# Altium schematic sheet SX126xMB2xAS_e588v01a.SchDoc
size A3; DocumentNumber: 1; SheetNumber: 1; SheetTotal: 2
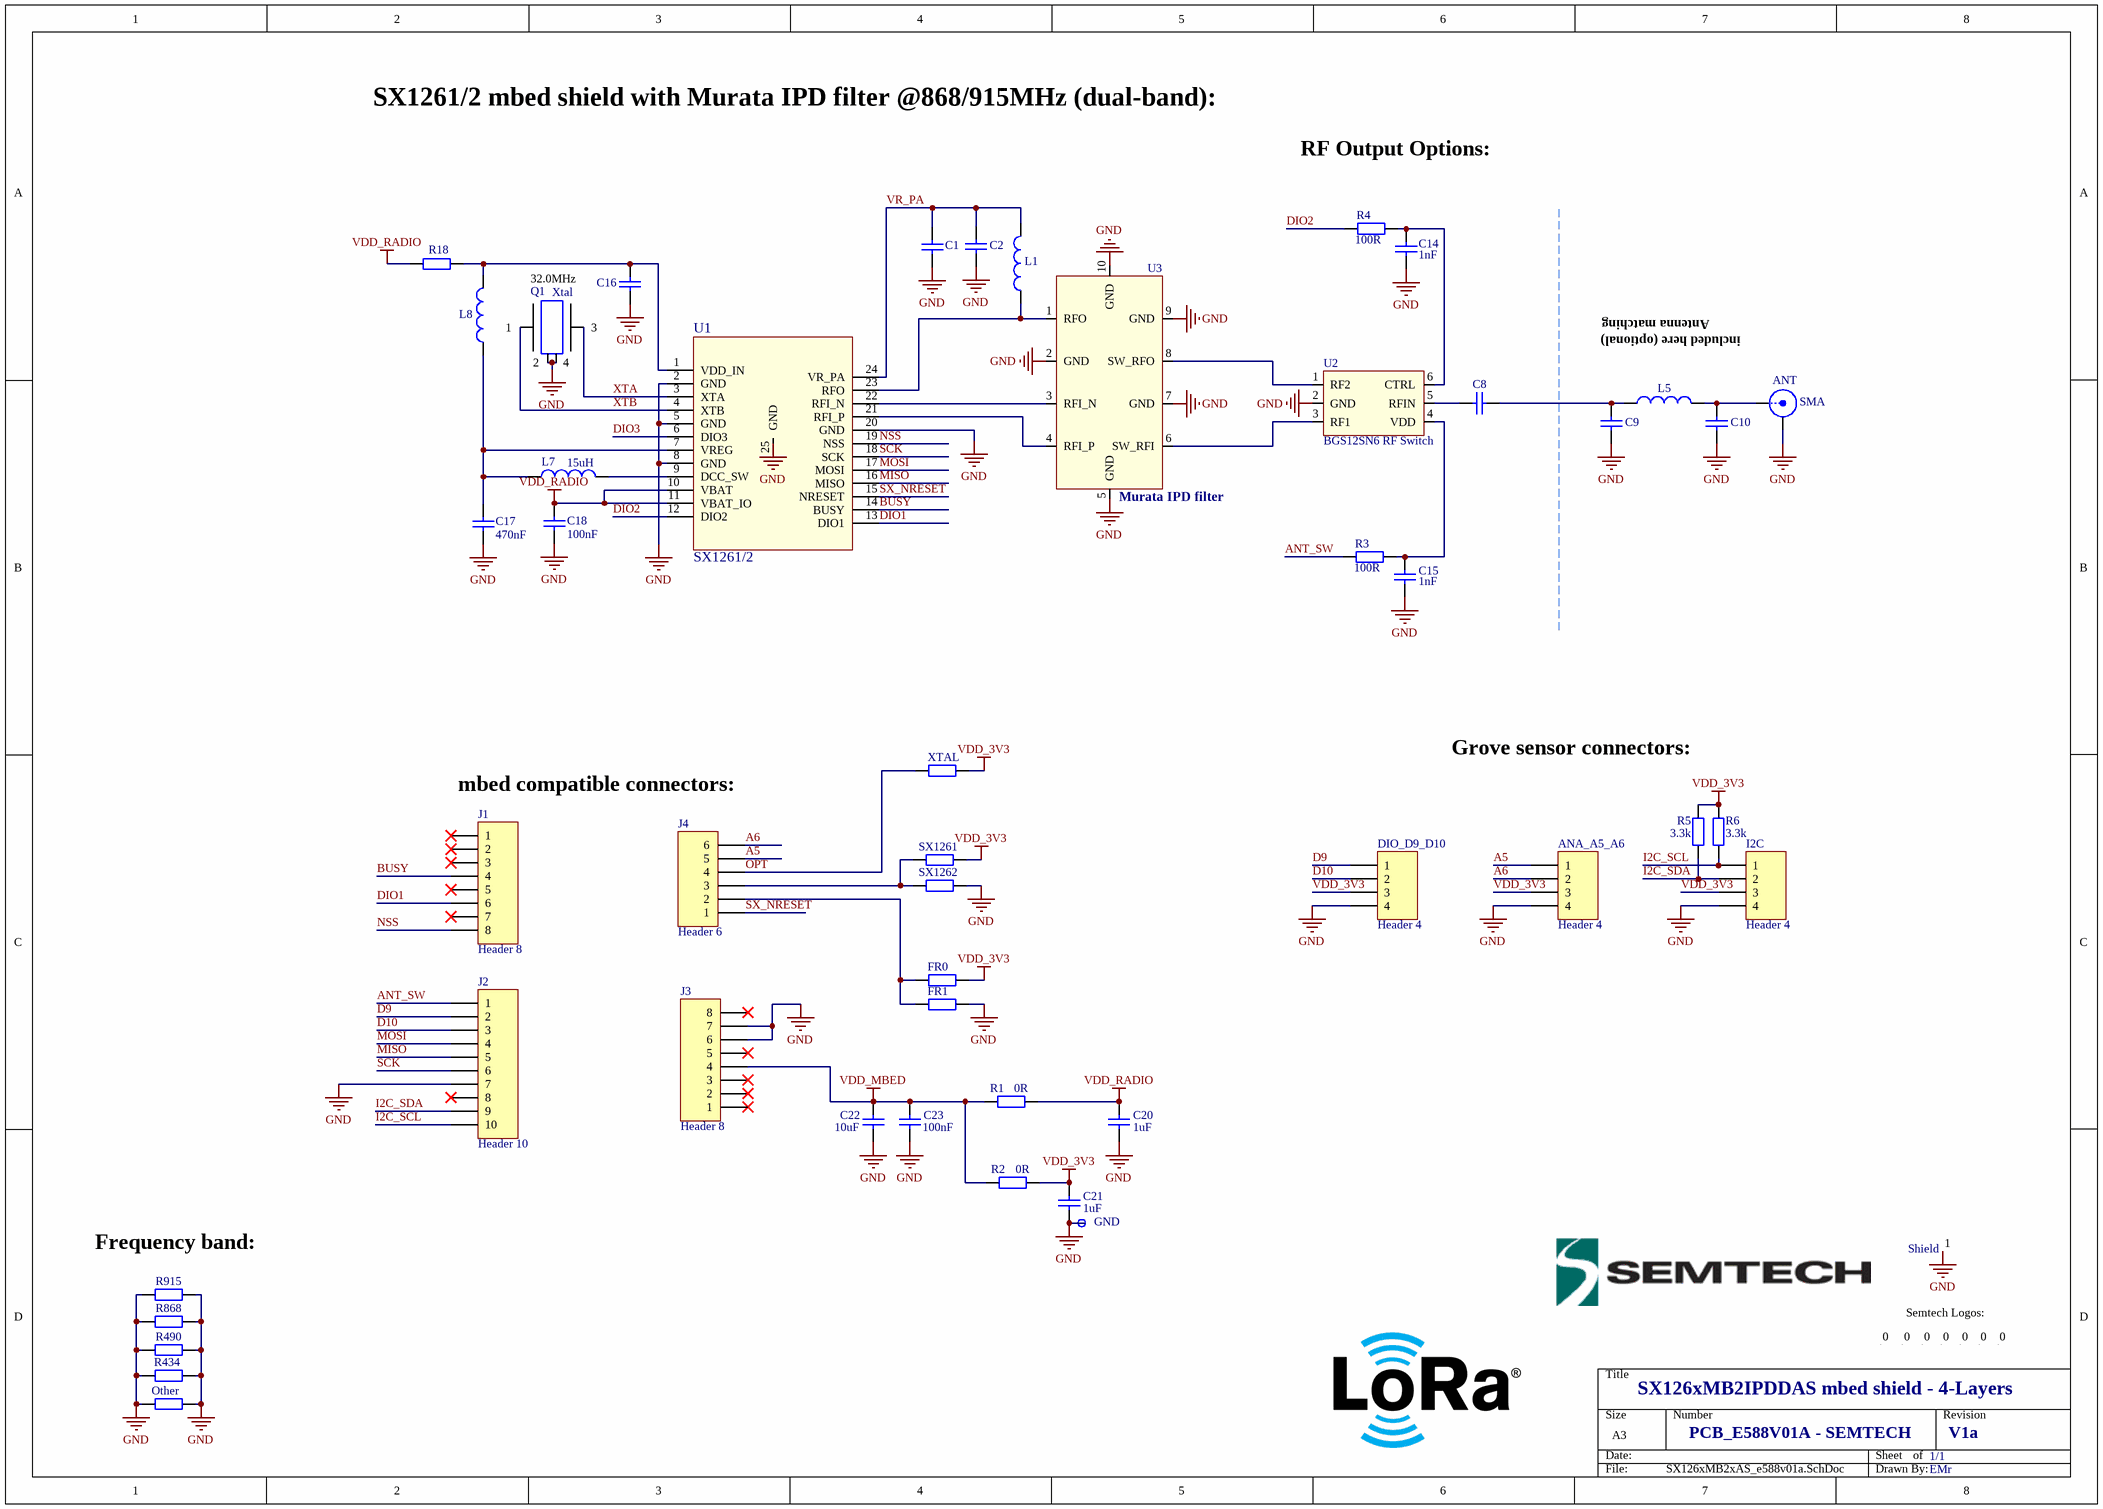
[diagram p0: SX126xMB2xAS_e588v01a.SchDoc]

## Parts
ANA_A5_A6  Header 4  [1125S-4P_connector]
ANT  SMA  [SMA_end_launch_1.0mm_9.52mm]
C1  Cap  [rlc_201_smd]  (value not drawn)
C2  Cap  [rlc_201_smd]  (value not drawn)
C8  Cap  [rlc_201_smd]  (value not drawn)
C9  Cap  [rlc_201_smd]  (value not drawn)
C10  Cap  [rlc_201_smd]  (value not drawn)
C14  value 1nF  [rlc_201_smd]  (hidden comment: Cap)
C15  value 1nF  [rlc_201_smd]  (hidden comment: Cap)
C16  Cap  [rlc_402_smd_small]  (value not drawn)
C17  value 470nF  [rlc_402_smd_small]  (hidden comment: Cap)
C18  value 100nF  [rlc_201_smd]  (hidden comment: Cap)
C20  value 1uF  [rlc_603_smd]  (hidden comment: Cap)
C21  value 1uF  [rlc_603_smd]  (hidden comment: Cap)
C22  value 10uF  [rlc_603_smd]  (hidden comment: Cap)
C23  value 100nF  [rlc_201_smd]  (hidden comment: Cap)
DIO_D9_D10  Header 4  [1125S-4P_connector]
FR0  Resistor  [rlc_402_smd]  (value not drawn)
FR1  Resistor  [rlc_402_smd]  (value not drawn)
GND  Test Pin  [pin_0.9mm]  (value not drawn)
I2C  Header 4  [1125S-4P_connector]
J1  Header 8  [HDR1X8]
J2  Header 10  [HDR1X10]
J3  Header 8  [HDR1X8]
J4  Header 6  [HDR1X6]
L1  Inductor  [rlc_402_smd_small]  (value not drawn)
L5  Inductor  [rlc_201_smd]  (value not drawn)
L7  value 15uH  [rlc_805_smd_small]  (hidden comment: Inductor)
L8  Inductor  [rlc_402_smd_small]  (value not drawn)
Logo_Bot1  Logo symbol  [Logo LoRa Size4]  (value not drawn)
Logo_ESD1  Logo symbol  [Logo ESD]  (value not drawn)
Logo_LoRA_Top1  Logo symbol  [Logo LoRa Size4]  (value not drawn)
Logo_mbed1  Logo symbol  [logo mbed 2]  (value not drawn)
Logo_Recycling1  Logo symbol  [Logo Recycling1]  (value not drawn)
Logo_Semtech1  Logo symbol  [logo_semtech_horiz_size4]  (value not drawn)
Logo_Semtech_1  Logo symbol  [logo_semtech_horiz_size3]  (value not drawn)
Other  Resistor  [rlc_402_smd]  (value not drawn)
Q1  Xtal  value 32.0MHz  [nd2016da]
R1  value 0R  [rlc_603_smd]  (hidden comment: Resistor)
R2  value 0R  [rlc_603_smd]  (hidden comment: Resistor)
R3  value 100R  [rlc_201_smd]  (hidden comment: Resistor)
R4  value 100R  [rlc_201_smd]  (hidden comment: Resistor)
R5  value 3.3k  [rlc_201_smd]  (hidden comment: Resistor)
R6  value 3.3k  [rlc_201_smd]  (hidden comment: Resistor)
R18  Resistor  [rlc_402_smd_small]  (value not drawn)
R434  Resistor  [rlc_402_smd]  (value not drawn)
R490  Resistor  [rlc_402_smd]  (value not drawn)
R868  Resistor  [rlc_402_smd]  (value not drawn)
R915  Resistor  [rlc_402_smd]  (value not drawn)
Shield  Logo symbol  [BMIS-209-F - Shield]  (value not drawn)
SX1261  Resistor  [rlc_402_smd]  (value not drawn)
SX1262  Resistor  [rlc_402_smd]  (value not drawn)
U1  SX1261/2  [vqfn24_4x4mm]
U2  BGS12SN6 RF Switch  [TSNP-6-2]
U3  Murata IPD filter  [IPD Filter]
XTAL  Resistor  [rlc_402_smd]  (value not drawn)

## Nets
GND: ANA_A5_A6.4 ANT.2(GND) C1.1 C2.1 C9.1 C10.1 C14.2 C15.2 C16.1 C17.1 C18.1 C20.1 C21.1 C22.1 C23.1 DIO_D9_D10.4 FR1.1 GND.1(pin) I2C.4 J2.7 J3.6 J3.7 Other.1 Other.2 Q1.2 Q1.4 R434.1 R434.2 R490.1 R490.2 R868.1 R868.2 R915.1 R915.2 Shield.1 SX1262.1 U1.2(GND) U1.5(GND) U1.8(GND) U1.20(GND) U1.25(GND) U2.2(GND) U3.2(GND) U3.5(GND) U3.7(GND) U3.9(GND) U3.10(GND)
VDD_3V3: ANA_A5_A6.3 C21.2 DIO_D9_D10.3 FR0.1 I2C.3 R2.1 R5.2 R6.2 SX1261.1 XTAL.1
VDD_MBED: C22.2 C23.2 J3.4 R1.2 R2.2
VDD_RADIO: C18.2 C20.2 R1.1 R18.2 U1.10(VBAT) U1.11(VBAT_IO)
A5: ANA_A5_A6.1 J4.5
A6: ANA_A5_A6.2 J4.6
ANT_SW: J2.1 R3.2
BUSY: J1.4 U1.14(BUSY)
D9: DIO_D9_D10.1 J2.2
D10: DIO_D9_D10.2 J2.3
DIO1: J1.6 U1.13(DIO1)
DIO2: R4.2 U1.12(DIO2)
DIO3: U1.6(DIO3)
I2C_SCL: I2C.1 J2.10 R6.1
I2C_SDA: I2C.2 J2.9 R5.1
MISO: J2.5 U1.16(MISO)
MOSI: J2.4 U1.17(MOSI)
NSS: J1.8 U1.19(NSS)
OPT: J4.4 XTAL.2
SCK: J2.6 U1.18(SCK)
SX_NRESET: J4.1 U1.15(NRESET)
VR_PA: C1.2 C2.2 L1.2 U1.24(VR_PA)
XTA: Q1.3 U1.3(XTA)
XTB: Q1.1 U1.4(XTB)
NetANT_1: ANT.1(Signal) C10.2 L5.2
NetC8_1: C8.1 C9.2 L5.1
NetC8_2: C8.2 U2.5(RFIN)
NetC14_1: C14.1 R4.1 U2.6(CTRL)
NetC15_1: C15.1 R3.1 U2.4(VDD)
NetC16_2: C16.2 L8.1 R18.1 U1.1(VDD_IN)
NetC17_2: C17.2 L7.1 L8.2 U1.7(VREG)
NetFR0_2: FR0.2 FR1.2 J4.2
NetJ4_3: J4.3 SX1261.2 SX1262.2
NetL1_1: L1.1 U1.23(RFO) U3.1(RFO)
NetL7_2: L7.2 U1.9(DCC_SW)
NetU1_21: U1.21(RFI_P) U3.4(RFI_P)
NetU1_22: U1.22(RFI_N) U3.3(RFI_N)
NetU2_1: U2.1(RF2) U3.8(SW_RFO)
NetU2_3: U2.3(RF1) U3.6(SW_RFI)

Not connected (* = marked no-connect by the designer): J1 1* 2* 3* 5* 7*; J2 8*; J3 1* 2* 3* 5* 8*; Logo_Bot1 0; Logo_ESD1 0; Logo_LoRA_Top1 0; Logo_mbed1 0; Logo_Recycling1 0; Logo_Semtech1 0; Logo_Semtech_1 0

## Notes on the sheet
- SX1261/2 mbed shield with Murata IPD filter @868/915MHz (dual-band):
- RF Output Options:
- Antenna matching
- included here (optional)
- Grove sensor connectors:
- mbed compatible connectors:
- (near R915) Frequency band:
- Semtech Logos:
- SX126xMB2IPDDAS mbed shield - 4-Layers
- PCB_E588V01A - SEMTECH
- 1/1
- V1a
- EMr

## Library data of the parts
ANA_A5_A6 DIO_D9_D10 I2C = Header 4: Header, 4-Pin; LatestRevisionDate: 17-Jul-2002; LatestRevisionNote: Re-released for DXP Platform.; Publisher: Altium Limited
ANT = SMA: SMA Straight Connector; LatestRevisionDate: 05-oct-2007  -  Semtech; LatestRevisionNote: Re-released for DXP Platform.; Publisher: Altium Limited
C1 C2 C8-C10 C16 = Cap: Capacitor SMD; Value: VAL?; Published: 8-Jun-2000; LatestRevisionDate: 05-oct-2007  -  Semtech; LatestRevisionNote: Re-released for DXP Platform.; Publisher: Altium Limited
C14 C15 C17 C18 C20-C23 = Cap: Capacitor SMD; Published: 8-Jun-2000; LatestRevisionDate: 05-oct-2007  -  Semtech; LatestRevisionNote: Re-released for DXP Platform.; Publisher: Altium Limited
FR0 XTAL = Resistor: Resistor SMD - IEC symbol version; Value: 1k; LatestRevisionDate: 27-Jul-20  -  Semtech
FR1 Other R434 R490 R868 R915 SX1261 = Resistor: Resistor SMD - IEC symbol version; Value: NC; LatestRevisionDate: 27-Jul-20  -  Semtech
GND = test_pin: LatestRevisionDate: 05-oct-2007  -  Semtech
J1 J3 = Header 8: Header, 8-Pin; LatestRevisionDate: 17-Jul-2002; LatestRevisionNote: Re-released for DXP Platform.; Publisher: Altium Limited
J2 = Header 10: Header, 10-Pin; LatestRevisionDate: 17-Jul-2002; LatestRevisionNote: Re-released for DXP Platform.; Publisher: Altium Limited
J4 = Header 6: Header, 6-Pin; LatestRevisionDate: 17-Jul-2002; LatestRevisionNote: Re-released for DXP Platform.; Publisher: Altium Limited
L1 L5 = Inductor: Inductor SMD; Code_IEC: 1005; Value: VAL?; Published: 8-Jun-2000; LatestRevisionDate: 05-oct-2007  -  Semtech; LatestRevisionNote: Re-released for DXP Platform.; Publisher: Altium Limited; Code_JEITA: 0402
L7 = Inductor: Inductor SMD; Code_IEC: 1005; Published: 8-Jun-2000; LatestRevisionDate: 05-oct-2007  -  Semtech; LatestRevisionNote: Re-released for DXP Platform.; Publisher: Altium Limited; Code_JEITA: 0402
L8 = Inductor: Inductor SMD; Value: NC; Code_IEC: 1005; LatestRevisionDate: 05-oct-2007  -  Semtech; Published: 8-Jun-2000; LatestRevisionNote: Re-released for DXP Platform.; Publisher: Altium Limited; Code_JEITA: 0402
Logo_Bot1 Logo_ESD1 Logo_LoRA_Top1 Logo_mbed1 Logo_Recycling1 Logo_Semtech1 Logo_Semtech_1 = Logo: Schematic symbol for Logo
Q1 = Xtal GND: Crystal with GND pins; LatestRevisionDate: 05-oct-2007  -  Semtech
R1-R6 = Resistor: Resistor SMD - IEC symbol version; LatestRevisionDate: 27-Jul-20  -  Semtech
R18 = Resistor: Resistor SMD - IEC symbol version; Value: 0R; LatestRevisionDate: 27-Jul-20  -  Semtech
Shield = Shield: Shield - EMI Gasket - Standard Surface Mount Shields
SX1262 = Resistor: Resistor SMD - IEC symbol version; Value: 10k; LatestRevisionDate: 27-Jul-20  -  Semtech
U1 = SX126x: SX1262- Ultra low power RF transceiver
U2 = BGS12SN6 RF Switch: BGS12SN6 Infineon RF Switch; LatestRevisionDate: 03-Sep-2012 -  Semtech
U3 = IPD filter: 0900FM15D0039 - Johanson IPD Filter for SX1261, SX1262; LatestRevisionDate: 05-oct-2007  -  Semtech